# Altium schematic sheet dsa.SchDoc: DSA
size Letter; CheckedBy: J. Brinton; CompanyName: Signal Laboratories, Inc.; DrawnBy: J. Brinton; Engineer: J. Brinton; Address1: 3479 Edison Way; Address2: Menlo Park CA 94025; Address3: +1 (877) 778-8435; Address4: siglabs.com; Revision: 3; SheetNumber: 15; SheetTotal: 49
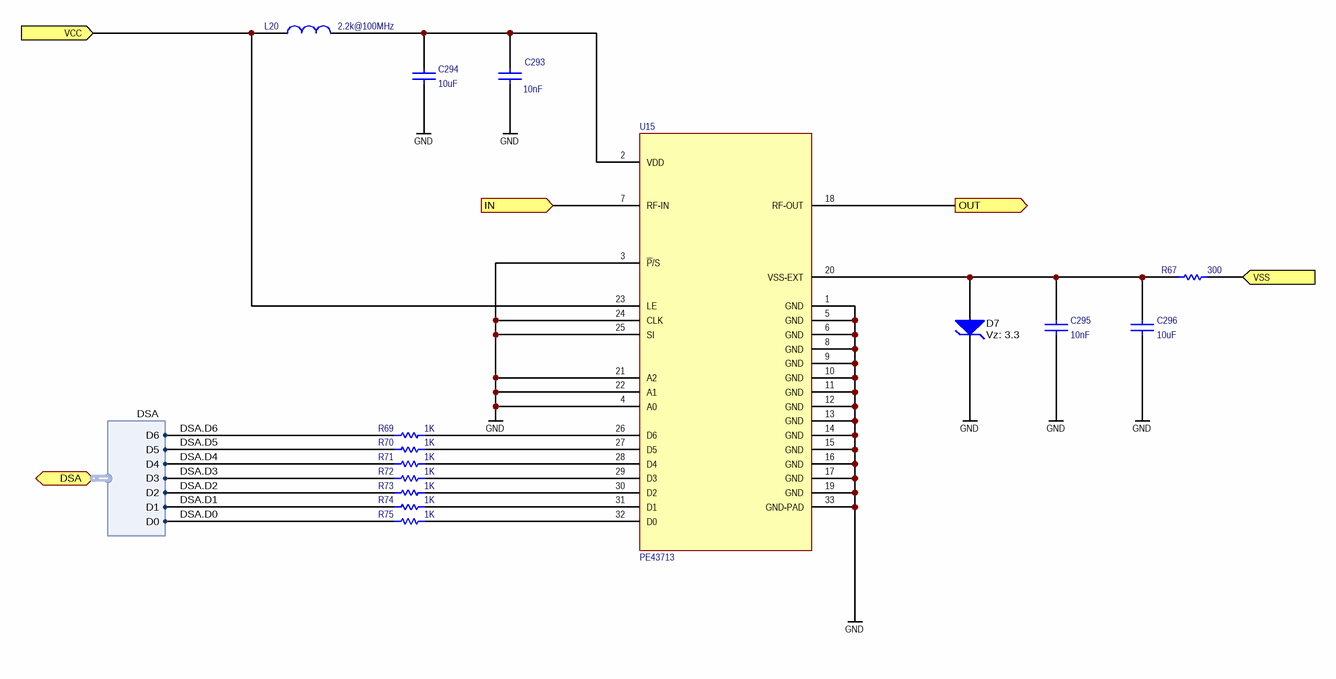
[diagram p0: dsa.SchDoc]

## Parts
C293  value 10nF  [CAPC100X50X55L25N]  (hidden comment: GRM155R71H103KA88)
C294  value 10uF  [CAPC160X80X90L20N]  (hidden comment: ZRB18AR61E106ME01L)
C295  value 10nF  [CAPC100X50X55L25N]  (hidden comment: GRM155R71H103KA88)
C296  value 10uF  [CAPC160X80X90L20N]  (hidden comment: ZRB18AR61E106ME01L)
D7  Vz: 3.3  [SOD523]  (hidden comment: BZT585B3V3T-7)
L20  value 2.2k@100MHz  [INDC1005X55N]  (hidden comment: MMZ1005A222ET000)
R67  value 300  [RESC2012X70N]  (hidden comment: RG2012P-301-B-T5)
R69  value 1K  [RESC1005X40N]  (hidden comment: RC0402FR-071KL)
R70  value 1K  [RESC1005X40N]  (hidden comment: RC0402FR-071KL)
R71  value 1K  [RESC1005X40N]  (hidden comment: RC0402FR-071KL)
R72  value 1K  [RESC1005X40N]  (hidden comment: RC0402FR-071KL)
R73  value 1K  [RESC1005X40N]  (hidden comment: RC0402FR-071KL)
R74  value 1K  [RESC1005X40N]  (hidden comment: RC0402FR-071KL)
R75  value 1K  [RESC1005X40N]  (hidden comment: RC0402FR-071KL)
U15  PE43713  [QFN-PE-32]

## Ports
DSA (harness DSA), IN (in), OUT (out), VCC (in), VSS (in)

## Harnesses
DSA: D6, D5, D4, D3, D2, D1, D0

## Nets
GND: C293.1 C294.1 C295.1 C296.1 D7.1(K) U15.1(GND) U15.3(~{P}/S) U15.4(A0) U15.5(GND) U15.6(GND) U15.8(GND) U15.9(GND) U15.10(GND) U15.11(GND) U15.12(GND) U15.13(GND) U15.14(GND) U15.15(GND) U15.16(GND) U15.17(GND) U15.19(GND) U15.21(A2) U15.22(A1) U15.24(CLK) U15.25(SI) U15.33(GND-PAD)
DSA.D0: R75.2 ; port DSA.D0
DSA.D1: R74.2 ; port DSA.D1
DSA.D2: R73.2 ; port DSA.D2
DSA.D3: R72.2 ; port DSA.D3
DSA.D4: R71.2 ; port DSA.D4
DSA.D5: R70.2 ; port DSA.D5
DSA.D6: R69.2 ; port DSA.D6
IN: U15.7(RF-IN) ; port IN
OUT: U15.18(RF-OUT) ; port OUT
VCC: L20.1 U15.23(LE) ; port VCC
VSS: R67.2 ; port VSS
NetC293_2: C293.2 C294.2 L20.2 U15.2(VDD)
NetC295_2: C295.2 C296.2 D7.2(A) R67.1 U15.20(VSS-EXT)
NetR69_1: R69.1 U15.26(D6)
NetR70_1: R70.1 U15.27(D5)
NetR71_1: R71.1 U15.28(D4)
NetR72_1: R72.1 U15.29(D3)
NetR73_1: R73.1 U15.30(D2)
NetR74_1: R74.1 U15.31(D1)
NetR75_1: R75.1 U15.32(D0)

## Notes on the sheet
- Title
- Engineer
- Revision
- Drawn By
- Checked By
- Date
- Sheet
- of

## Library data of the parts
C293 C295 = CAP 0402: Ceramic Capacitor 10nF ±10% 50V X7R 0402; Manufacturer: Murata; Tr: -55:125; Voltage: 50V; Manufacturer P/N: GRM155R71H103KA88; Package: 0402; Tolerance: ±10%
C294 C296 = CAP 0603: Ceramic Capacitor 10uF ±20% 25V X5R 0603; Manufacturer: Murata; Tr: -55:85; Manufacturer P/N: ZRB18AR61E106ME01L; Voltage: 25V; Package: 0603; Tolerance: ±20%
D7 = ZENER: 3.3V Zener Diode SOD-523; Manufacturer: Diodes Inc; Manufacturer P/N: BZT585B3V3T-7
L20 = INDUCTANCE1: Ferrite Bead 2.2k@100MHz 150mA 0402; Manufacturer: TDK; Tr: -55:125; Manufacturer P/N: MMZ1005A222ET000; Package: 0402
R67 = RES: Thin Film Resistor 300 +/-0.1% SMD 0805; Manufacturer: Susumu; Tolerance: ±0.1%; Tr: -55:155; Tcr: *; Manufacturer P/N: RG2012P-301-B-T5; Alternatives: *; Voltage: *; Power: *; Package: 0805
R69-R75 = RES 0402: Thick Film Resistor 1k ±1% 0402; Manufacturer: Yageo; Tr: -55:155; Package: 0402; Manufacturer P/N: RC0402FR-071KL; Do Not Place: *; Tolerance: ±1%
U15 = PE43713: Digital Step Attenuaator, 9kHz-6GHz; Manufacturer: Peregrine Semiconductor; Manufacturer P/N: PE43713